# EAGLE schematic FaceCam (EAGLE 9.3.1)

## Sheet 1 of 2
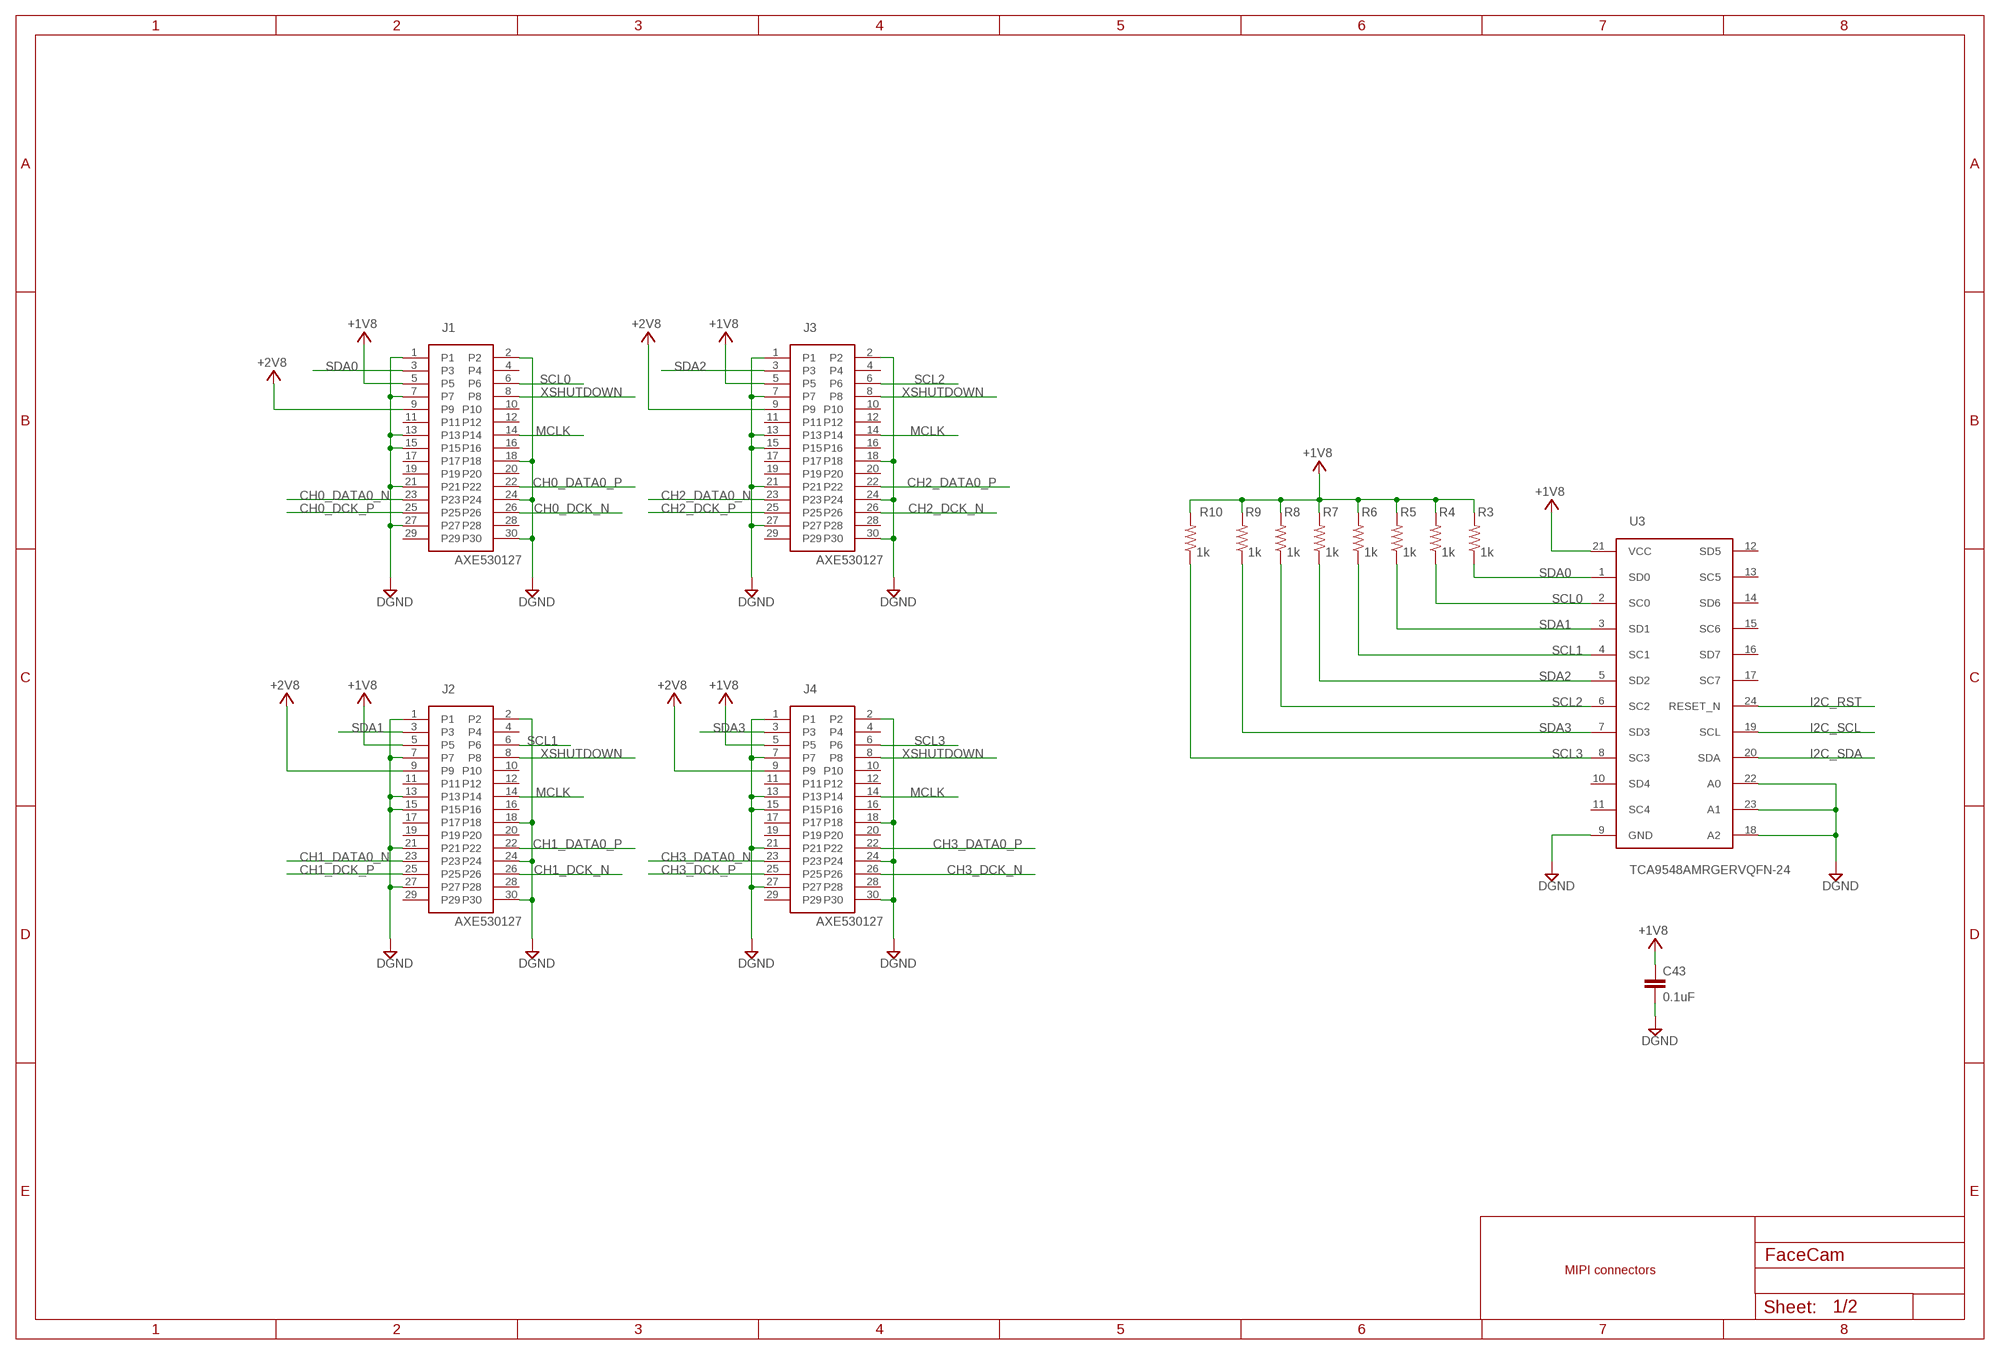
[diagram p0: schematic, sheet 1, part 1 of 2]
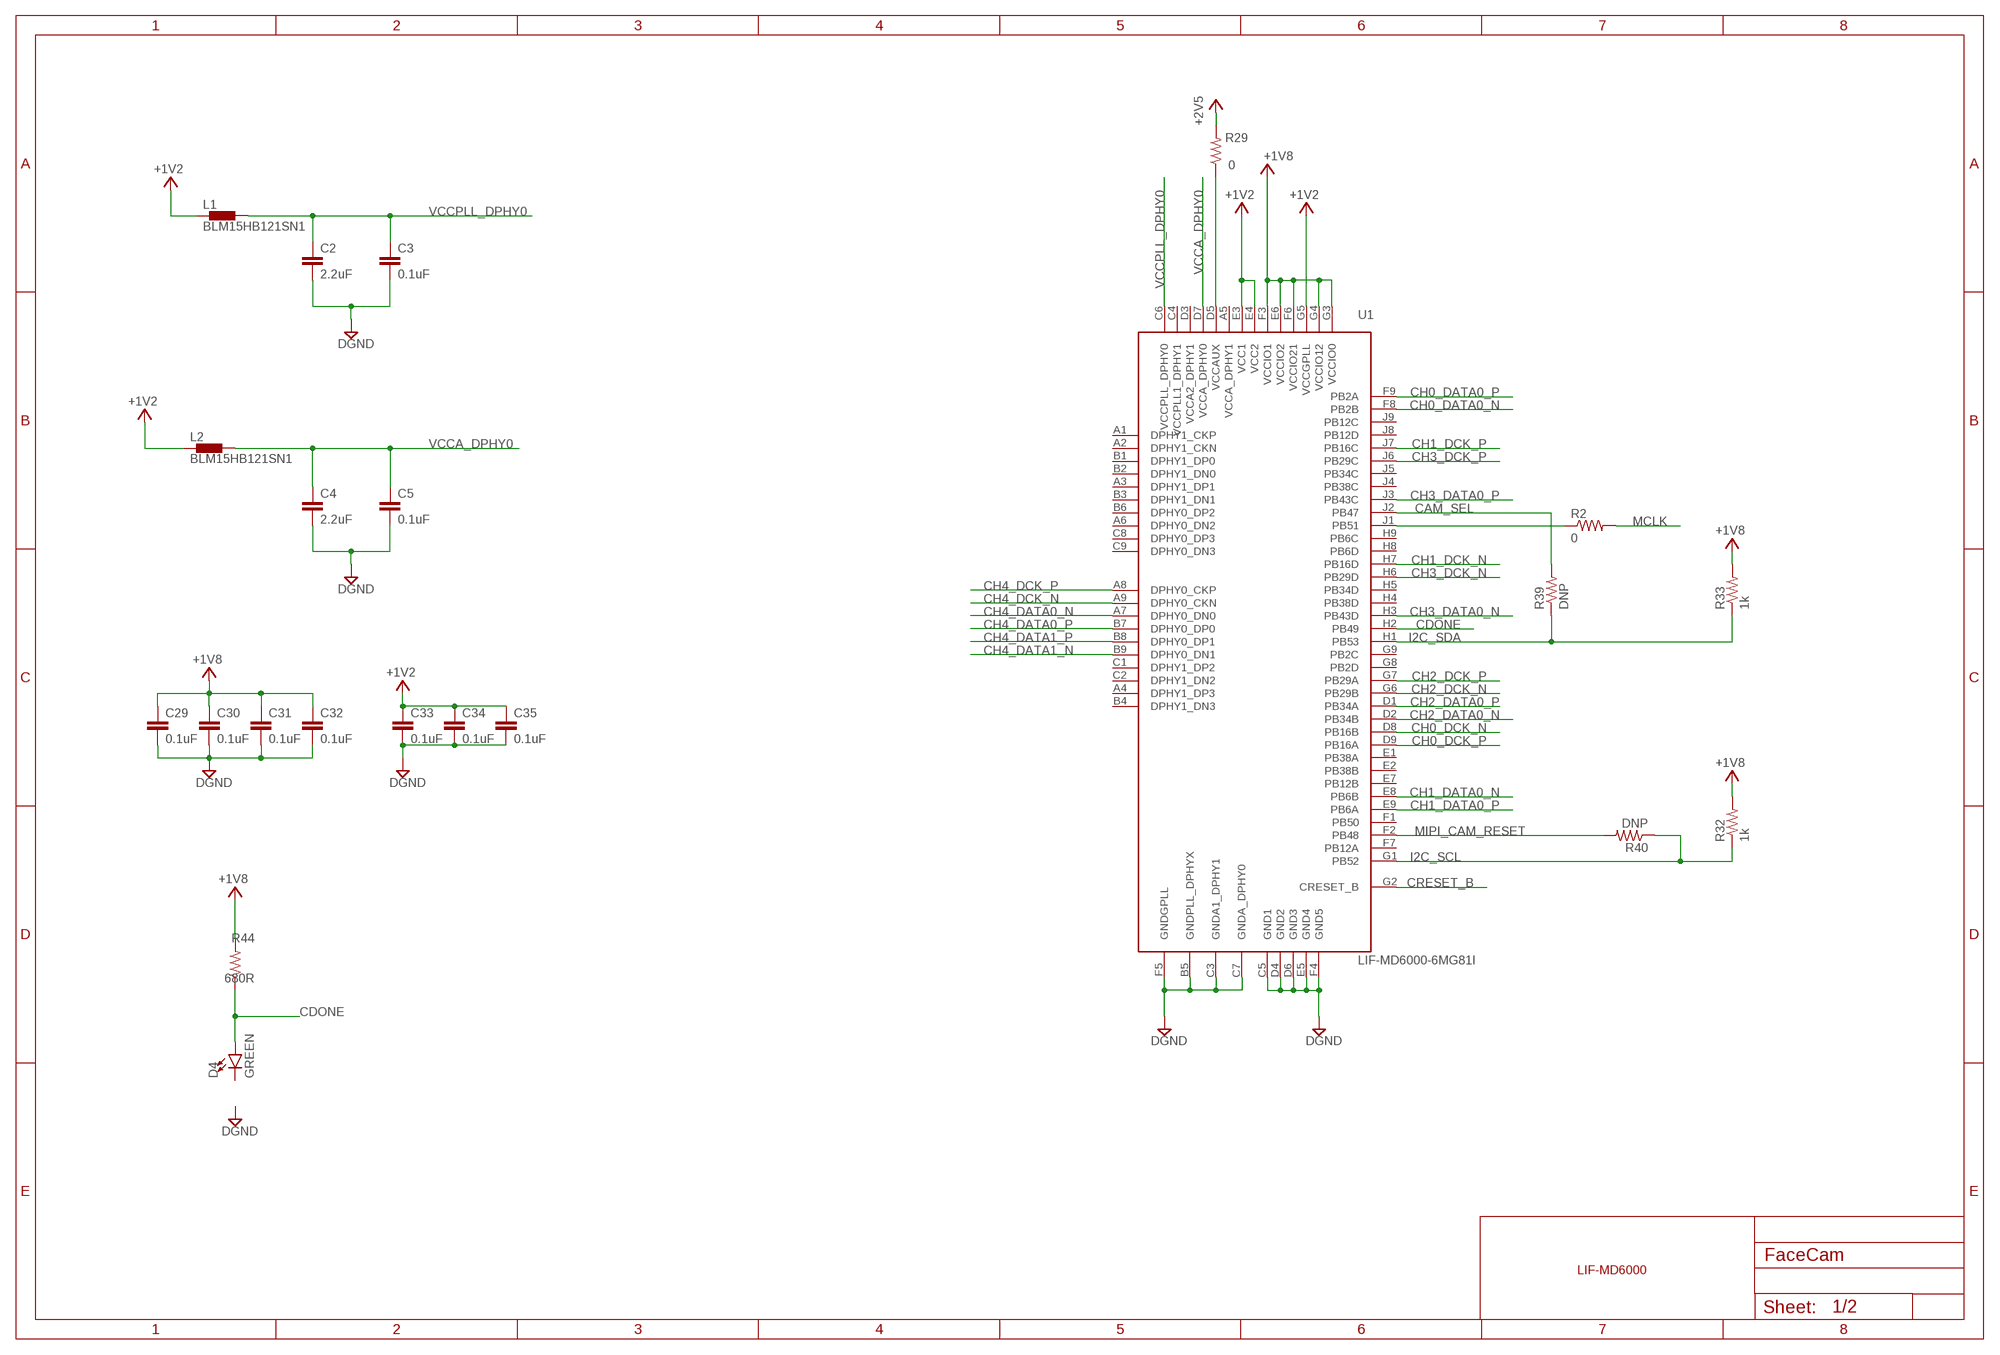
[diagram p1: schematic, sheet 1, part 2 of 2]

### Parts
C2  2.2uF  C-EUC0402  [C0402]
C3  0.1uF  C-EUC0402  [C0402]
C4  2.2uF  C-EUC0402  [C0402]
C5  0.1uF  C-EUC0402  [C0402]
C29  0.1uF  C-EUC0402  [C0402]
C30  0.1uF  C-EUC0402  [C0402]
C31  0.1uF  C-EUC0402  [C0402]
C32  0.1uF  C-EUC0402  [C0402]
C33  0.1uF  C-EUC0402  [C0402]
C34  0.1uF  C-EUC0402  [C0402]
C35  0.1uF  C-EUC0402  [C0402]
C43  0.1uF  C-EUC0402  [C0402]
D4  GREEN  LED-GREEN0603  [LED-0603]
J1  AXE530127  [AXE530127]
J2  AXE530127  [AXE530127]
J3  AXE530127  [AXE530127]
J4  AXE530127  [AXE530127]
L1  BLM15HB121SN1  [0402]
L2  BLM15HB121SN1  [0402]
R2  0  R-US_R0402  [R0402]
R3  1k  R-US_R0402  [R0402]
R4  1k  R-US_R0402  [R0402]
R5  1k  R-US_R0402  [R0402]
R6  1k  R-US_R0402  [R0402]
R7  1k  R-US_R0402  [R0402]
R8  1k  R-US_R0402  [R0402]
R9  1k  R-US_R0402  [R0402]
R10  1k  R-US_R0402  [R0402]
R29  0  R-US_R0402  [R0402]
R32  1k  R-US_R0402  [R0402]
R33  1k  R-US_R0402  [R0402]
R39  DNP  R-US_R0402  [R0402]
R40  DNP  R-US_R0402  [R0402]
R44  680R  R-US_R0402  [R0402]
U1  LIF-MD6000-6MG81I  [CSFBGA81]
U3  TCA9548AMRGERVQFN-24  [HVQFN24]

### Nets
+1V2: C33.1 C34.1 C35.1 L1.1 L2.1 U1.E3(VCC1) U1.E4(VCC2) U1.G5(VCCGPLL) ; also sheet 2
+1V8: C29.1 C30.1 C31.1 C32.1 C43.1 J1.5 J1.9 J2.5 J2.9 J3.5 J3.9 J4.5 J4.9 R3.2 R4.2 R5.2 R6.2 R7.2 R8.2 R9.2 R10.2 R32.2 R33.2 R44.2 U1.E6(VCCIO2) U1.F3(VCCIO1) U1.F6(VCCIO21) U1.G3(VCCIO0) U1.G4(VCCIO12) U3.21(VCC) ; supply symbol labelled +2V8 ; also sheet 2
+2V5: R29.2 ; also sheet 2
CAM_SEL: R39.2 U1.J2(PB47) ; also sheet 2
CDONE: D4.A R44.1 U1.H2(PB49) ; also sheet 2
CH0_DATA0_N: J1.23 U1.F8(PB2B)
CH0_DATA0_P: J1.22 U1.F9(PB2A)
CH0_DCK_N: J1.26 U1.D8(PB16B)
CH0_DCK_P: J1.25 U1.D9(PB16A)
CH1_DATA0_N: J2.23 U1.E8(PB6B)
CH1_DATA0_P: J2.22 U1.E9(PB6A)
CH1_DCK_N: J2.26 U1.H7(PB16D)
CH1_DCK_P: J2.25 U1.J7(PB16C)
CH2_DATA0_N: J3.23 U1.D2(PB34B)
CH2_DATA0_P: J3.22 U1.D1(PB34A)
CH2_DCK_N: J3.26 U1.G6(PB29B)
CH2_DCK_P: J3.25 U1.G7(PB29A)
CH3_DATA0_N: J4.23 U1.H3(PB43D)
CH3_DATA0_P: J4.22 U1.J3(PB43C)
CH3_DCK_N: J4.26 U1.H6(PB29D)
CH3_DCK_P: J4.25 U1.J6(PB29C)
CH4_DATA0_N: U1.A7(DPHY0_DN0) ; also sheet 2
CH4_DATA0_P: U1.B7(DPHY0_DP0) ; also sheet 2
CH4_DATA1_N: U1.B9(DPHY0_DN1) ; also sheet 2
CH4_DATA1_P: U1.B8(DPHY0_DP1) ; also sheet 2
CH4_DCK_N: U1.A9(DPHY0_CKN) ; also sheet 2
CH4_DCK_P: U1.A8(DPHY0_CKP) ; also sheet 2
CRESET_B: U1.G2(CRESET_B) ; also sheet 2
DGND: C2.2 C3.2 C4.2 C5.2 C29.2 C30.2 C31.2 C32.2 C33.2 C34.2 C35.2 C43.2 J1.1 J1.2 J1.7 J1.13 J1.15 J1.18 J1.21 J1.24 J1.27 J1.30 J2.1 J2.2 J2.7 J2.13 J2.15 J2.18 J2.21 J2.24 J2.27 J2.30 J3.1 J3.2 J3.7 J3.13 J3.15 J3.18 J3.21 J3.24 J3.27 J3.30 J4.1 J4.2 J4.7 J4.13 J4.15 J4.18 J4.21 J4.24 J4.27 J4.30 U1.B5(GNDPLL_DPHYX) U1.C3(GNDA1_DPHY1) U1.C5(GND1) U1.C7(GNDA_DPHY0) U1.D4(GND2) U1.D6(GND3) U1.E5(GND4) U1.F4(GND5) U1.F5(GNDGPLL) U3.9(GND) U3.18(A2) U3.22(A0) U3.23(A1) ; also sheet 2
I2C_RST: U3.24(RESET_N) ; also sheet 2
I2C_SCL: R32.1 R40.1 U1.G1(PB52) U3.19(SCL) ; also sheet 2
I2C_SDA: R33.1 R39.1 U1.H1(PB53) U3.20(SDA) ; also sheet 2
MCLK: J1.14 J2.14 J3.14 J4.14 R2.2 ; also sheet 2
MIPI_CAM_RESET: R40.2 U1.F2(PB48) ; also sheet 2
N$2: R2.1 U1.J1(PB51)
N$23: R29.1 U1.D5(VCCAUX)
SCL0: J1.6 R4.1 U3.2(SC0)
SCL1: J2.6 R6.1 U3.4(SC1)
SCL2: J3.6 R8.1 U3.6(SC2)
SCL3: J4.6 R10.1 U3.8(SC3)
SDA0: J1.3 R3.1 U3.1(SD0)
SDA1: J2.3 R5.1 U3.3(SD1)
SDA2: J3.3 R7.1 U3.5(SD2)
SDA3: J4.3 R9.1 U3.7(SD3)
VCCA_DPHY0: C4.1 C5.1 L2.2 U1.D7(VCCA_DPHY0)
VCCPLL_DPHY0: C2.1 C3.1 L1.2 U1.C6(VCCPLL_DPHY0)
XSHUTDOWN: J1.8 J2.8 J3.8 J4.8 ; also sheet 2
Unconnected: D4.C J1.4 J1.10 J1.11 J1.12 J1.16 J1.17 J1.19 J1.20 J1.28 J1.29 J2.4 J2.10 J2.11 J2.12 J2.16 J2.17 J2.19 J2.20 J2.28 J2.29 J3.4 J3.10 J3.11 J3.12 J3.16 J3.17 J3.19 J3.20 J3.28 J3.29 J4.4 J4.10 J4.11 J4.12 J4.16 J4.17 J4.19 J4.20 J4.28 J4.29 U1.A1(DPHY1_CKP) U1.A2(DPHY1_CKN) U1.A3(DPHY1_DP1) U1.A4(DPHY1_DP3) U1.A5(VCCA_DPHY1) U1.A6(DPHY0_DN2) U1.B1(DPHY1_DP0) U1.B2(DPHY1_DN0) U1.B3(DPHY1_DN1) U1.B4(DPHY1_DN3) U1.B6(DPHY0_DP2) U1.C1(DPHY1_DP2) U1.C2(DPHY1_DN2) U1.C4(VCCPLL1_DPHY1) U1.C8(DPHY0_DP3) U1.C9(DPHY0_DN3) U1.D3(VCCA2_DPHY1) U1.E1(PB38A) U1.E2(PB38B) U1.E7(PB12B) U1.F1(PB50) U1.F7(PB12A) U1.G8(PB2D) U1.G9(PB2C) U1.H4(PB38D) U1.H5(PB34D) U1.H8(PB6D) U1.H9(PB6C) U1.J4(PB38C) U1.J5(PB34C) U1.J8(PB12D) U1.J9(PB12C) U3.10(SD4) U3.11(SC4) U3.12(SD5) U3.13(SC5) U3.14(SD6) U3.15(SC6) U3.16(SD7) U3.17(SC7)

### Notes on the sheet
- MIPI connectors | LIF-MD6000

## Sheet 2 of 2
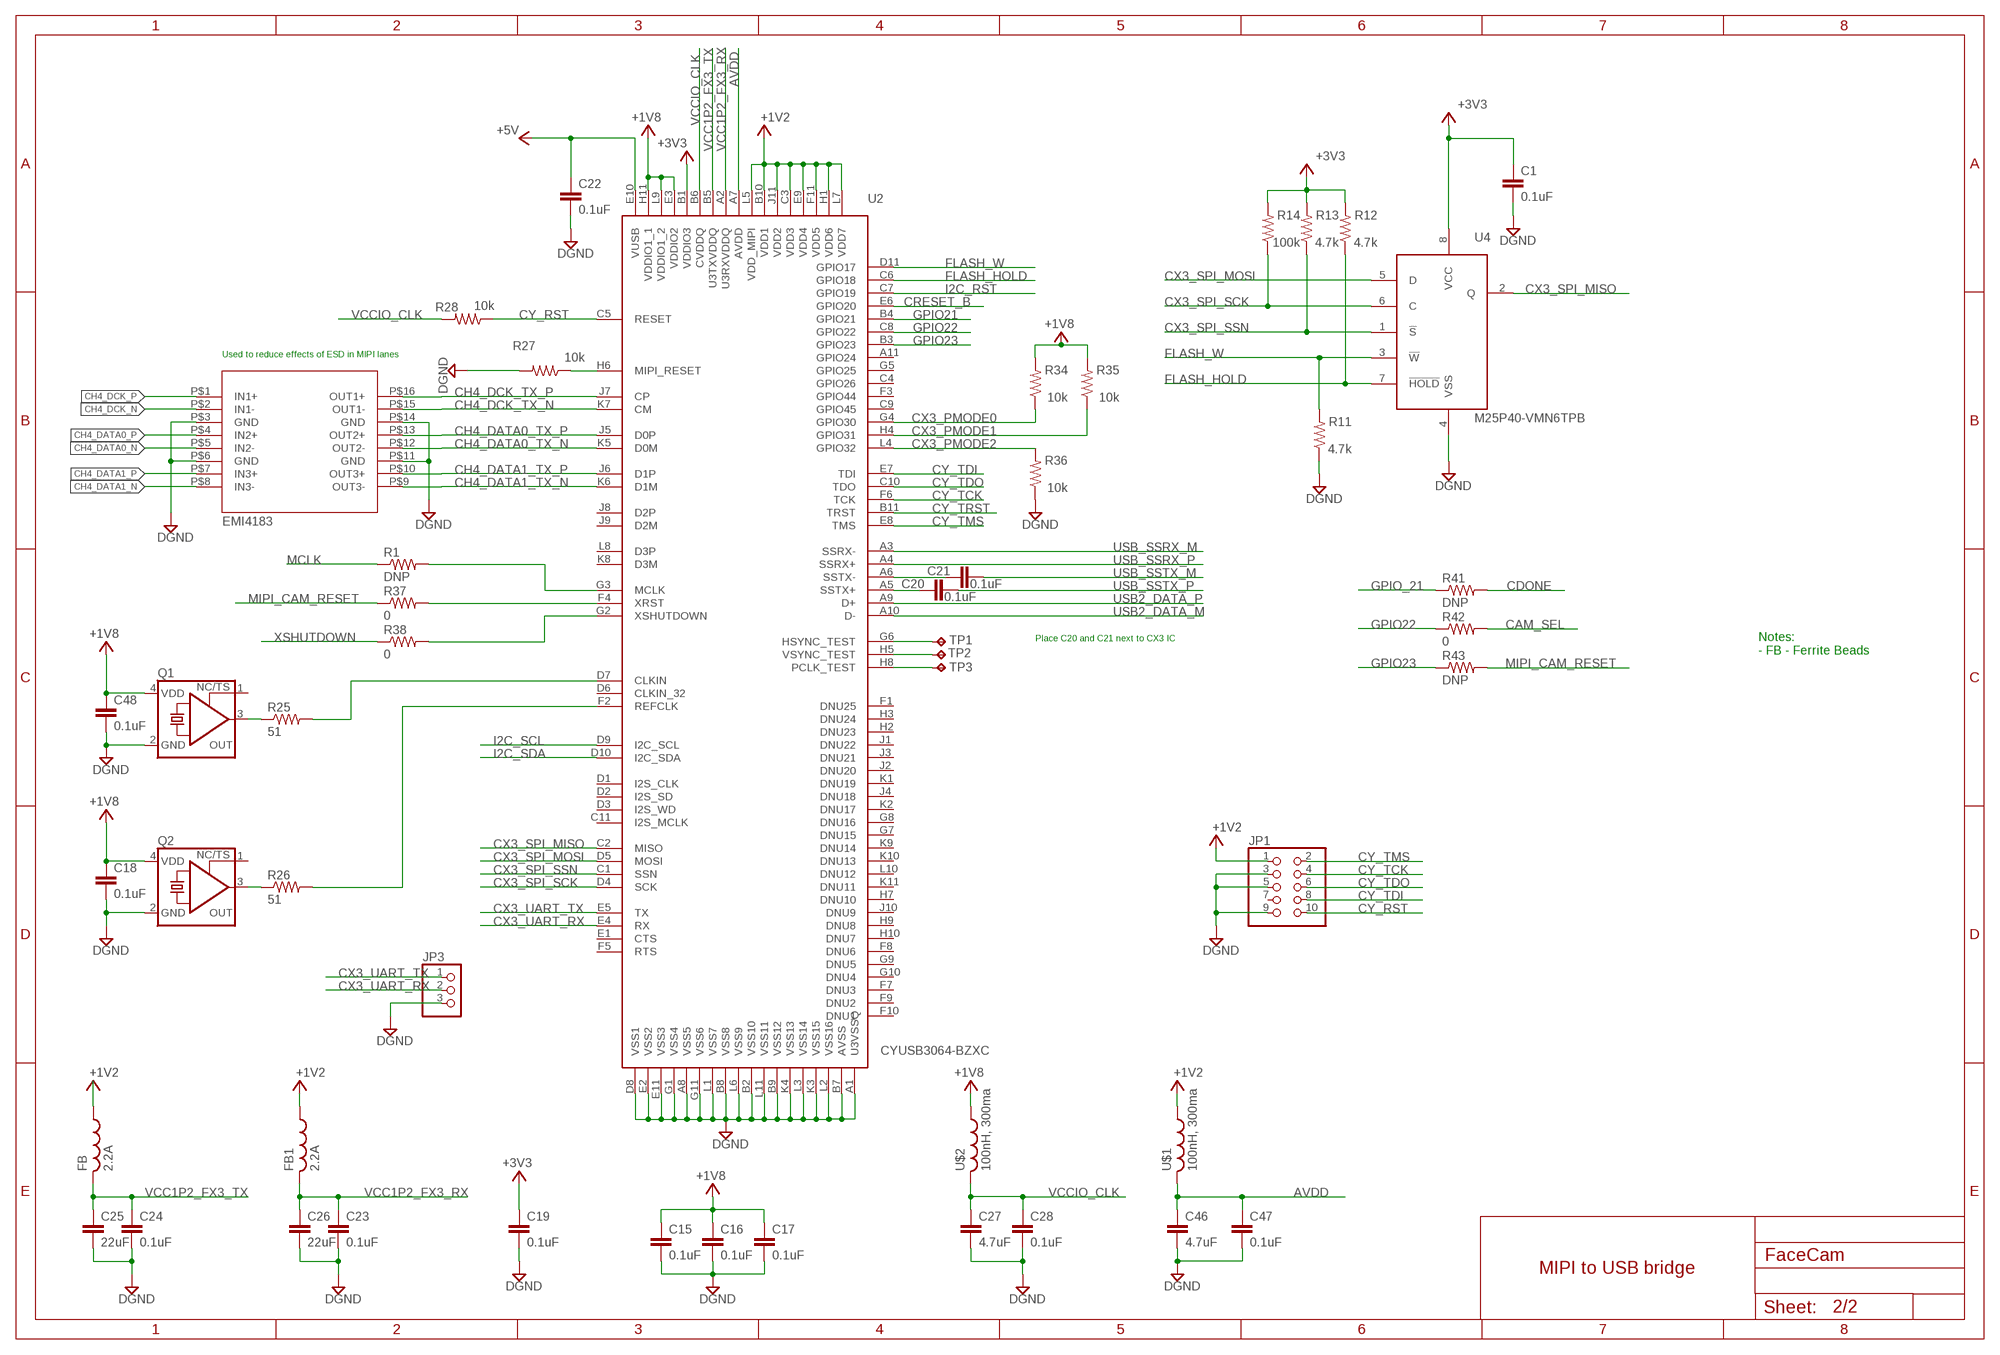
[diagram p2: schematic, sheet 2, part 1 of 2]
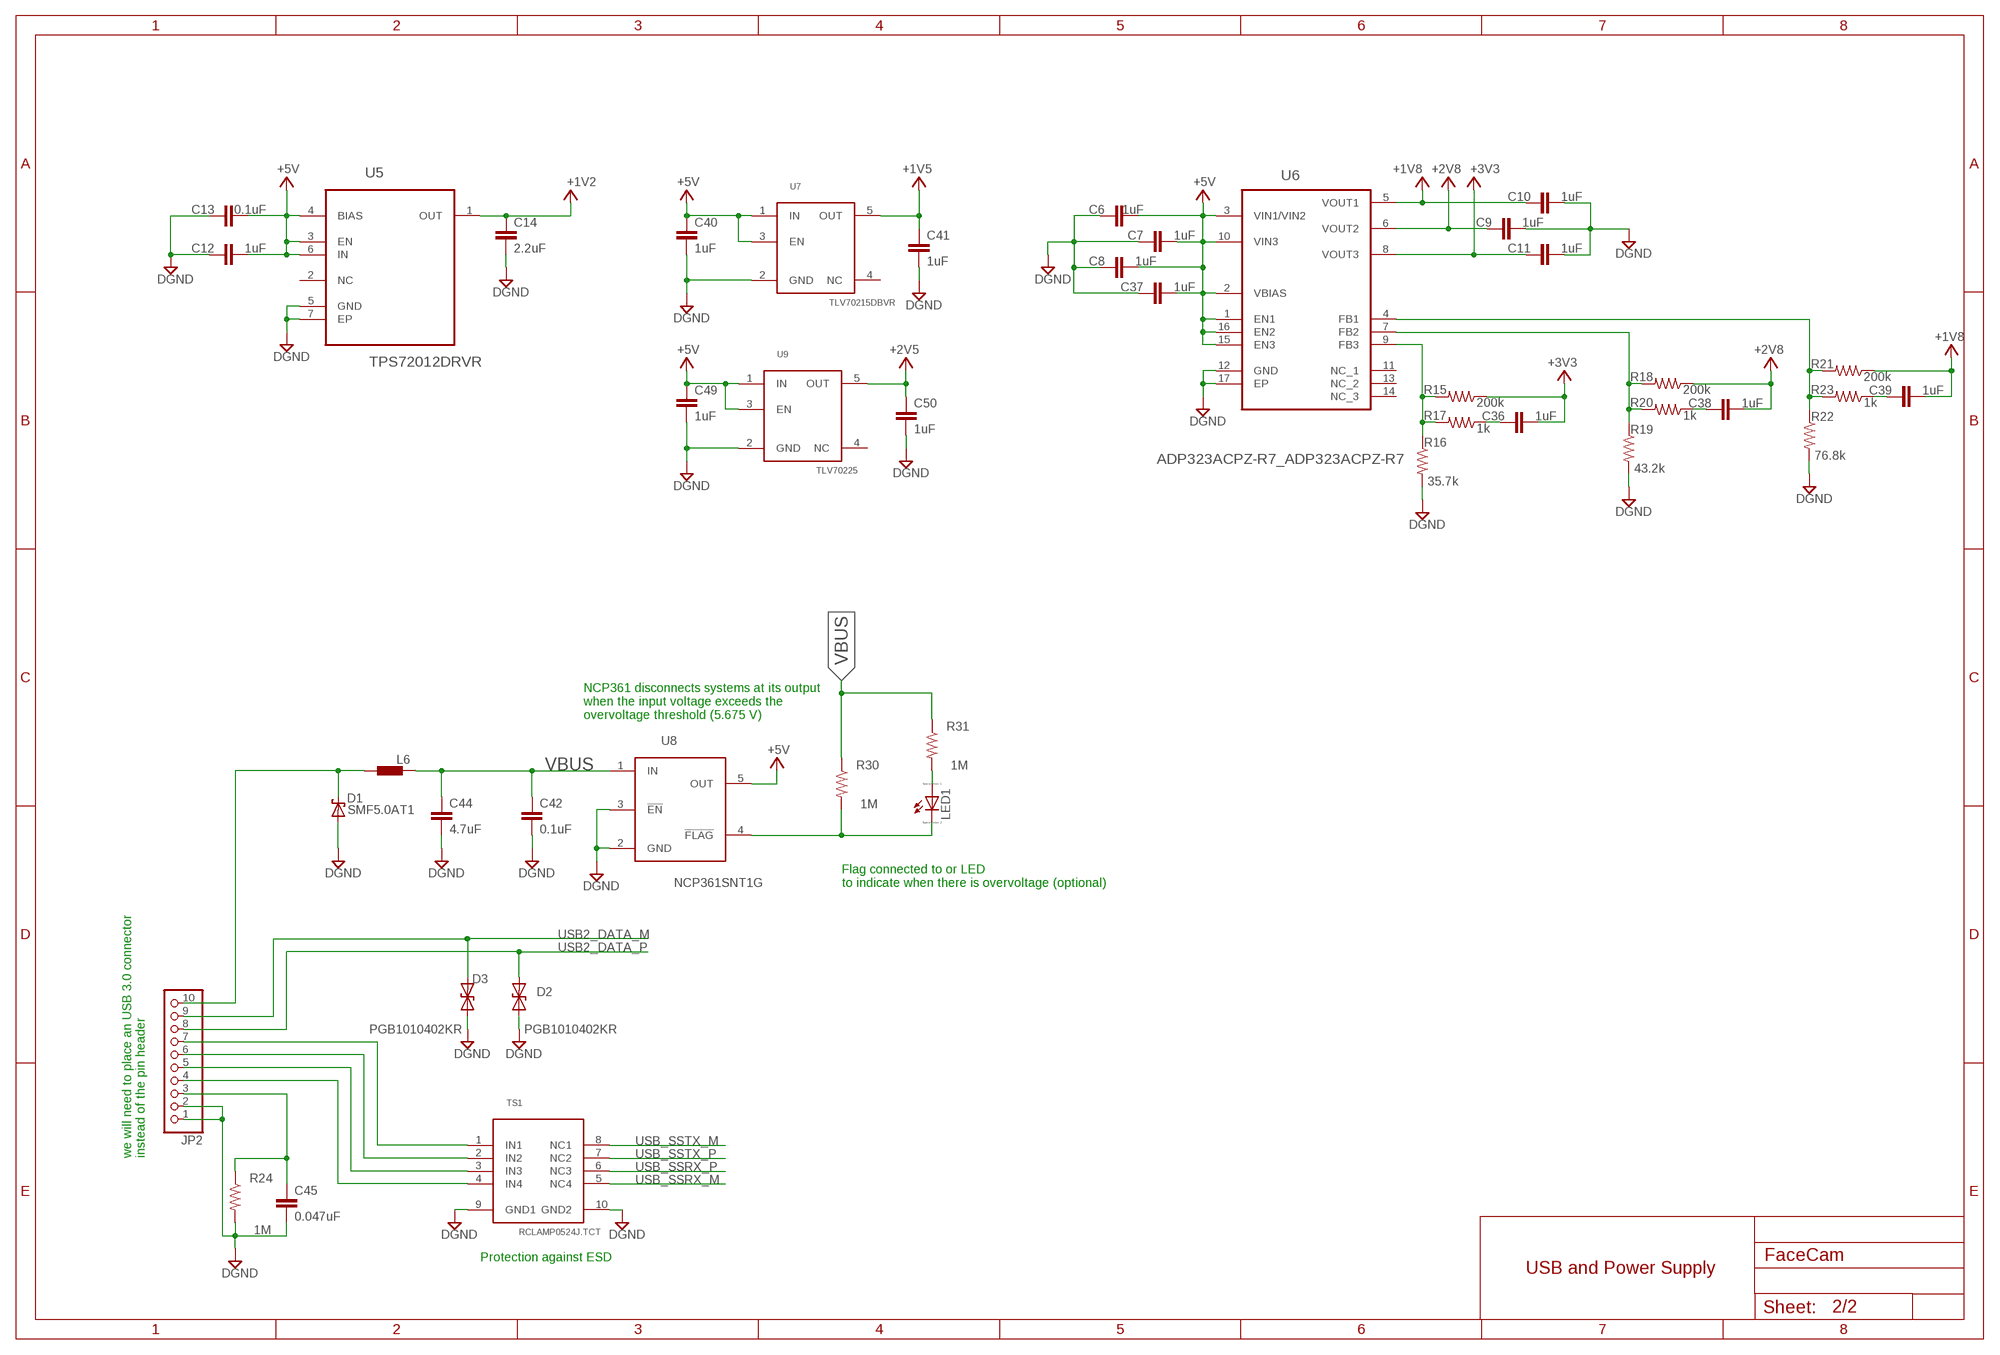
[diagram p3: schematic, sheet 2, part 2 of 2]

### Parts
C1  0.1uF  C-EUC0402  [C0402]
C6  1uF  C-EUC0402  [C0402]
C7  1uF  C-EUC0402  [C0402]
C8  1uF  C-EUC0402  [C0402]
C9  1uF  C-EUC0402  [C0402]
C10  1uF  C-EUC0402  [C0402]
C11  1uF  C-EUC0402  [C0402]
C12  1uF  C-EUC0402  [C0402]
C13  0.1uF  C-EUC0402  [C0402]
C14  2.2uF  C-EUC0402  [C0402]
C15  0.1uF  C-EUC0402  [C0402]
C16  0.1uF  C-EUC0402  [C0402]
C17  0.1uF  C-EUC0402  [C0402]
C18  0.1uF  C-EUC0402  [C0402]
C19  0.1uF  C-EUC0402  [C0402]
C20  0.1uF  C-EUC0402  [C0402]
C21  0.1uF  C-EUC0402  [C0402]
C22  0.1uF  C-EUC0402  [C0402]
C23  0.1uF  C-EUC0402  [C0402]
C24  0.1uF  C-EUC0402  [C0402]
C25  22uF  C-EUC0805  [C0805]
C26  22uF  C-EUC0805  [C0805]
C27  4.7uF  C-EUC0402  [C0402]
C28  0.1uF  C-EUC0402  [C0402]
C36  1uF  C-EUC0402  [C0402]
C37  1uF  C-EUC0402  [C0402]
C38  1uF  C-EUC0402  [C0402]
C39  1uF  C-EUC0402  [C0402]
C40  1uF  C-EUC0402  [C0402]
C41  1uF  C-EUC0402  [C0402]
C42  0.1uF  C-EUC0402  [C0402]
C44  4.7uF  C-EUC0805  [C0805]
C45  0.047uF  C-EUC0402  [C0402]
C46  4.7uF  C-EUC0402  [C0402]
C47  0.1uF  C-EUC0402  [C0402]
C48  0.1uF  C-EUC0402  [C0402]
C49  1uF  C-EUC0402  [C0402]
C50  1uF  C-EUC0402  [C0402]
D1  SMF5.0AT1  [SOD123FL]
D2  PGB1010402KR  [DIODE0402]
D3  PGB1010402KR  [DIODE0402]
EMI4183  EMI4183  [WDFN16]
FB  2.2A  INDUCTOR_0402_N  [RESC0402_N]
FB1  2.2A  INDUCTOR_0402_N  [RESC0402_N]
JP1  PINHD-2X5  [2X05]
JP2  PINHD-1X10  [1X10]
JP3  PINHD-1X3  [1X03]
L6  BLM15HG601SN1  [0402]
LED1  LED_ESML0603  [LED_SML0603]
Q1  KXO-PXO/XO-V94  [2.0X1.6_KXO-V94]
Q2  KXO-PXO/XO-V94  [2.0X1.6_KXO-V94]
R1  DNP  R-US_R0402  [R0402]
R11  4.7k  R-US_R0402  [R0402]
R12  4.7k  R-US_R0402  [R0402]
R13  4.7k  R-US_R0402  [R0402]
R14  100k  R-US_R0402  [R0402]
R15  200k  R-US_R0402  [R0402]
R16  35.7k  R-US_R0402  [R0402]
R17  1k  R-US_R0402  [R0402]
R18  200k  R-US_R0402  [R0402]
R19  43.2k  R-US_R0402  [R0402]
R20  1k  R-US_R0402  [R0402]
R21  200k  R-US_R0402  [R0402]
R22  76.8k  R-US_R0402  [R0402]
R23  1k  R-US_R0402  [R0402]
R24  1M  R-US_R0402  [R0402]
R25  51  R-US_R0402  [R0402]
R26  51  R-US_R0402  [R0402]
R27  10k  R-US_R0402  [R0402]
R28  10k  R-US_R0402  [R0402]
R30  1M  R-US_R0402  [R0402]
R31  1M  R-US_R0402  [R0402]
R34  10k  R-US_R0402  [R0402]
R35  10k  R-US_R0402  [R0402]
R36  10k  R-US_R0402  [R0402]
R37  0  R-US_R0402  [R0402]
R38  0  R-US_R0402  [R0402]
R41  DNP  R-US_R0402  [R0402]
R42  0  R-US_R0402  [R0402]
R43  DNP  R-US_R0402  [R0402]
TP1  TPB1,27  [B1,27]
TP2  TPB1,27  [B1,27]
TP3  TPB1,27  [B1,27]
TS1  RCLAMP0524J.TCT  [RCLAMP0524J]
U2  CYUSB3064-BZXC  [BGA121]
U4  M25P40-VMN6TPB  [SOIC8]
U5  TPS72012DRVR  [SON65P200X200X80-7N]
U6  ADP323ACPZ-R7_ADP323ACPZ-R7  [ADP323ACPZ-R7_QFN50P300X300X80-17N]
U7  TLV70215DBVR  [SOT23-5]
U8  NCP361SNT1G  [SOT23-5]
U9  TLV70225  [SOT23-5]
U$1  100nH, 300ma  INDUCTOR_0402_N  [RESC0402_N]
U$2  100nH, 300ma  INDUCTOR_0402_N  [RESC0402_N]

### Nets
+1V2: C14.2 FB1.1 FB.1 JP1.1 U2.B10(VDD1) U2.C3(VDD3) U2.E9(VDD4) U2.F11(VDD5) U2.H1(VDD6) U2.J11(VDD2) U2.L5(VDD_MIPI) U2.L7(VDD7) U5.1(OUT) U$1.1 ; also sheet 1
+1V5: C41.2 U7.5(OUT)
+1V8: C10.1 C15.1 C16.1 C17.1 C18.1 C39.2 C48.1 Q1.4(VDD) Q2.4(VDD) R21.1 R34.2 R35.2 U2.E3(VDDIO2) U2.H11(VDDIO1_1) U2.L9(VDDIO1_2) U6.5(VOUT1) U$2.1 ; also sheet 1
+2V5: C50.2 U9.5(OUT) ; also sheet 1
+2V8: C9.1 C38.2 R18.1 U6.6(VOUT2)
+3V3: C1.1 C11.1 C19.1 C36.2 R12.2 R13.2 R14.2 R15.1 U2.B1(VDDIO3) U4.8(VCC) U6.8(VOUT3)
+5V: C6.2 C7.2 C8.2 C12.2 C13.2 C22.1 C37.2 C40.2 C49.2 U2.E10(VUSB) U5.3(EN) U5.4(BIAS) U5.6(IN) U6.1(EN1) U6.2(VBIAS) U6.3(VIN1/VIN2) U6.10(VIN3) U6.15(EN3) U6.16(EN2) U7.1(IN) U7.3(EN) U8.5(OUT) U9.1(IN) U9.3(EN)
AVDD: C46.1 C47.1 U2.A7(AVDD) U$1.2
CAM_SEL: R42.2 ; also sheet 1
CDONE: R41.2 ; also sheet 1
CH4_DATA0_N: EMI4183.P$5(IN2-) ; also sheet 1
CH4_DATA0_P: EMI4183.P$4(IN2+) ; also sheet 1
CH4_DATA0_TX_N: EMI4183.P$12(OUT2-) U2.K5(D0M)
CH4_DATA0_TX_P: EMI4183.P$13(OUT2+) U2.J5(D0P)
CH4_DATA1_N: EMI4183.P$8(IN3-) ; also sheet 1
CH4_DATA1_P: EMI4183.P$7(IN3+) ; also sheet 1
CH4_DATA1_TX_N: EMI4183.P$9(OUT3-) U2.K6(D1M)
CH4_DATA1_TX_P: EMI4183.P$10(OUT3+) U2.J6(D1P)
CH4_DCK_N: EMI4183.P$2(IN1-) ; also sheet 1
CH4_DCK_P: EMI4183.P$1(IN1+) ; also sheet 1
CH4_DCK_TX_N: EMI4183.P$15(OUT1-) U2.K7(CM)
CH4_DCK_TX_P: EMI4183.P$16(OUT1+) U2.J7(CP)
CRESET_B: U2.E6(GPIO20) ; also sheet 1
CX3_PMODE0: R34.1 U2.G4(GPIO30)
CX3_PMODE1: R35.1 U2.H4(GPIO31)
CX3_PMODE2: R36.2 U2.L4(GPIO32)
CX3_SPI_MISO: U2.C2(MISO) U4.2(Q)
CX3_SPI_MOSI: U2.D5(MOSI) U4.5(D)
CX3_SPI_SCK: R14.1 U2.D4(SCK) U4.6(C)
CX3_SPI_SSN: R13.1 U2.C1(SSN) U4.1(!S)
CX3_UART_RX: JP3.2 U2.E4(RX)
CX3_UART_TX: JP3.1 U2.E5(TX)
CY_RST: JP1.10 R28.1 U2.C5(RESET)
CY_TCK: JP1.4 U2.F6(TCK)
CY_TDI: JP1.8 U2.E7(TDI)
CY_TDO: JP1.6 U2.C10(TDO)
CY_TMS: JP1.2 U2.E8(TMS)
CY_TRST: U2.B11(TRST)
DGND: C1.2 C6.1 C7.1 C8.1 C9.2 C10.2 C11.2 C12.1 C13.1 C14.1 C15.2 C16.2 C17.2 C18.2 C19.2 C22.2 C23.2 C24.2 C25.2 C26.2 C27.2 C28.2 C37.1 C40.1 C41.1 C42.2 C44.2 C45.2 C46.2 C47.2 C48.2 C49.1 C50.1 D1.A D2.1 D3.1 EMI4183.P$3(GND) EMI4183.P$6(GND) EMI4183.P$11(GND) EMI4183.P$14(GND) JP1.3 JP1.5 JP1.9 JP2.1 JP2.2 JP3.3 Q1.2(GND) Q2.2(GND) R11.1 R16.2 R19.2 R22.2 R24.2 R27.2 R36.1 TS1.9(GND1) TS1.10(GND2) U2.A1(U3VSSQ) U2.A8(VSS5) U2.B2(VSS10) U2.B7(AVSS) U2.B8(VSS8) U2.B9(VSS12) U2.D8(VSS1) U2.E2(VSS2) U2.E11(VSS3) U2.G1(VSS4) U2.G11(VSS6) U2.K3(VSS15) U2.K4(VSS13) U2.L1(VSS7) U2.L2(VSS16) U2.L3(VSS14) U2.L6(VSS9) U2.L11(VSS11) U4.4(VSS) U5.5(GND) U5.7(EP) U6.12(GND) U6.17(EP) U7.2(GND) U8.2(GND) U8.3(!EN) U9.2(GND) ; also sheet 1
FLAG: LED1.C R30.2 U8.4(!FLAG)
FLASH_HOLD: R12.1 U2.C6(GPIO18) U4.7(!HOLD)
FLASH_W: R11.2 U2.D11(GPIO17) U4.3(!W)
GPIO21: U2.B4(GPIO21)
GPIO22: R42.1 U2.C8(GPIO22)
GPIO23: R43.1 U2.B3(GPIO23)
GPIO_21: R41.1
I2C_RST: U2.C7(GPIO19) ; also sheet 1
I2C_SCL: U2.D9(I2C_SCL) ; also sheet 1
I2C_SDA: U2.D10(I2C_SDA) ; also sheet 1
MCLK: R1.1 ; also sheet 1
MIPI_CAM_RESET: R37.1 R43.2 ; also sheet 1
N$1: R1.2 U2.G3(MCLK)
N$3: R15.2 R16.1 R17.2 U6.9(FB3)
N$4: D1.C JP2.10 L6.2
N$5: Q1.3(OUT) R25.1
N$6: LED1.A R31.2
N$7: Q2.3(OUT) R26.1
N$8: C45.1 JP2.3 R24.1
N$9: R25.2 U2.D7(CLKIN)
N$10: R26.2 U2.F2(REFCLK)
N$11: R27.1 U2.H6(MIPI_RESET)
N$12: C36.1 R17.1
N$13: R37.2 U2.F4(XRST)
N$14: TP1.TP U2.G6(HSYNC_TEST)
N$15: R38.2 U2.G2(XSHUTDOWN)
N$16: TP2.TP U2.H5(VSYNC_TEST)
N$17: TP3.TP U2.H8(PCLK_TEST)
N$21: R18.2 R19.1 R20.2 U6.7(FB2)
N$22: C38.1 R20.1
N$25: R21.2 R22.1 R23.2 U6.4(FB1)
N$26: C39.1 R23.1
N$27: C21.1 U2.A6(SSTX-)
N$28: C20.1 U2.A5(SSTX+)
N$33: JP2.7 TS1.1(IN1)
N$34: JP2.6 TS1.2(IN2)
N$35: JP2.5 TS1.3(IN3)
N$36: JP2.4 TS1.4(IN4)
USB2_DATA_M: D3.2 JP2.9 U2.A10(D-)
USB2_DATA_P: D2.2 JP2.8 U2.A9(D+)
USB_SSRX_M: TS1.5(NC4) U2.A3(SSRX-)
USB_SSRX_P: TS1.6(NC3) U2.A4(SSRX+)
USB_SSTX_M: C21.2 TS1.8(NC1)
USB_SSTX_P: C20.2 TS1.7(NC2)
VBUS: C42.1 C44.1 L6.1 R30.1 R31.1 U8.1(IN)
VCC1P2_FX3_RX: C23.1 C26.1 FB1.2 U2.A2(U3RXVDDQ)
VCC1P2_FX3_TX: C24.1 C25.1 FB.2 U2.B5(U3TXVDDQ)
VCCIO_CLK: C27.1 C28.1 R28.2 U2.B6(CVDDQ) U$2.2
XSHUTDOWN: R38.1 ; also sheet 1
Unconnected: JP1.7 Q1.1(TS) Q2.1(TS) U2.A11(GPIO24) U2.C4(GPIO26) U2.C9(GPIO45) U2.C11(I2S_MCLK) U2.D1(I2S_CLK) U2.D2(I2S_SD) U2.D3(I2S_WD) U2.D6(CLKIN_32) U2.E1(CTS) U2.F1(DNU25) U2.F3(GPIO44) U2.F5(RTS) U2.F7(DNU3) U2.F8(DNU6) U2.F9(DNU2) U2.F10(DNU1) U2.G5(GPIO25) U2.G7(DNU15) U2.G8(DNU16) U2.G9(DNU5) U2.G10(DNU4) U2.H2(DNU23) U2.H3(DNU24) U2.H7(DNU10) U2.H9(DNU8) U2.H10(DNU7) U2.J1(DNU22) U2.J2(DNU20) U2.J3(DNU21) U2.J4(DNU18) U2.J8(D2P) U2.J9(D2M) U2.J10(DNU9) U2.K1(DNU19) U2.K2(DNU17) U2.K8(D3M) U2.K9(DNU14) U2.K10(DNU13) U2.K11(DNU11) U2.L8(D3P) U2.L10(DNU12) U5.2(NC) U6.11(NC_1) U6.13(NC_2) U6.14(NC_3) U7.4(NC) U9.4(NC)

### Notes on the sheet
- Used to reduce effects of ESD in MIPI lanes
- Place C20 and C21 next to CX3 IC
- Notes:
  - FB - Ferrite Beads
- Notes:
  - FB - Ferrite Beads
- NCP361 disconnects systems at its output
  when the input voltage exceeds the
  overvoltage threshold (5.675 V)
- Flag connected to or LED
  to indicate when there is overvoltage (optional)
- we will need to place an USB 3.0 connector 
  instead of the pin header
- Protection against ESD
- MIPI to USB bridge | USB and Power Supply

## Library data of the parts
C1-C24 C27-C43 C45-C50 = rcl:C-EU: CAPACITOR, European symbol; SPICEPREFIX: C
C25 C26 C44 = resistor:C-EU: CAPACITOR, European symbol
D1 = diode:SMF5.0AT1: 200 W Transient Voltage Suppressor Source: Data sheet <http://www.onsemi.com/pub_link/Collateral/SMF5.0AT1-D.PDF>
D2 D3 = diode:PGB1010402KR
D4 = SparkFun-LED:LED-GREEN: Green SMD LED Used in manufacturing of various products at SparkFun Packages: 0603 - SMD 0603 package [Product Link] <http://www.futureelectronics.com/en/technologies/semiconductors/optoelectronics/leds/Pages/9894312-LTST-C190GKT.aspx?CrossPart=HSMG-C190&IM=0> LilyPad 1206 - SMD1206 LilyPad package [Product Link] <http://www.futureelectronics.com/en/Technologies/Product.aspx?ProductID=IN150NGHARVATEKCORPORATION2049943&IM=0> 1206 - SMD1206 package [Product Link] <http://www.futureelectronics.com/en/technologies/semiconductors/optoelectronics/leds/Pages/8315665-LTST-C150KGKT.aspx?IM=0> 1206 Bottom Mount -SMD 1206 Bottom Mount [Product Link] <http://www.digikey.com/product-detail/en/lite-on-inc/LTST-C230KGKT/160-1456-1-ND/386854> SparkFun Products: Pro Mini 328 -5V <https://www.sparkfun.com/products/821> RedBoard <https://www.sparkfun.com/products/12757> MP3 Trigger <https://www.sparkfun.com/products/13720> Makey Makey <https://www.sparkfun.com/products/11076>; PROD_ID: DIO-00821
EMI4183 = yhtomit_ICs:EMI4183
FB FB1 U$1 U$2 = Nordic_nRF:INDUCTOR: Generic chip inductor
J1-J4 = library:AXE530127
JP1 = pinhead:PINHD-2X5: PIN HEADER
JP2 = pinhead:PINHD-1X10: PIN HEADER
JP3 = pinhead:PINHD-1X3: PIN HEADER
L1 L2 L6 = inductors:BLM15H: EMIFIL (R) Chip Ferrite Bead for GHz Noise Source: http://www.murata.com/ Ferrite Bead BLM15H.pdf
LED1 = eagle-ltspice:LED_E: LED Source: http://www.osram.convergy.de Source: www.luxeon.com Source: www.kingbright.com; SPICEMODEL: NONE; SPICEPREFIX: D; SPICETYPE: diode
Q1 Q2 = crystal-geyer_V1_0:KXO-PXO/XO-V: Clock Oscillator (PXO/XO) MHz : KXO-V - Serie Model Size l/w/h [mm] Frequency Range Frequency Stability Temp. Range [°C] Output AECQ 200 availabel Datasheet KXO-V94 KXO-V94 KXO-V95 KXO-V95 KXO-V96 KXO-V96 KXO-V99 KXO-V99 KXO-97 KXO-V97 KXO-97 - KXO-V97 2.0/1.6/0.80 2.0/1.6/0.80 2.5/2.0/0.82 2.5/2.0/0.82 3.2/2.5/1.2 3.2/2.5/1.2 5.0/3.2/1.2 5.0/3.2/1.2 7.0/5.08/1.3 7.0/5.08/1.3 7.0/5.08/1.3 32,768 kHz 1,0 ~ 80,0 MHz 32,768 kHz 1,0 ~ 70,0 MHz 32,768 kHz 1,0 ~ 156,0 MHz 32,768 kHz 1,0 ~ 200,0 MHz 32,768 kHz 32,768 kHz 1,0 ~ 160,0 MHz ±25 … ±100ppm ±25 … ±100ppm ±25 … ±100ppm ±25 … ±100ppm ±25 … ±100ppm ±25 … ±100ppm ±25 … ±100ppm ±25 … ±100ppm ±25 … ±100ppm ±25 … ±100ppm ±25 … ±100ppm (*) -40°C …+85°C (*) -40°C …+85°C (*) -40°C …+85°C (*) -40°C …+85°C (*) -40°C …+85°C (*) -40°C …+85°C (*) -40°C …+85°C (*) -40°C …+85°C (*) -40°C …+85°C (*) -40°C …+85°C (*) -40°C …+85°C HCMOS HCMOS HCMOS HCMOS HCMOS HCMOS HCMOS HCMOS HCMOS HCMOS HCMOS - - yes yes yes yes - - - - - KXO-V94-kHz.pdf <http://www.geyer-electronic.de/uploads/tx_userartikelfrequenz/GEYER-KXO-V94-kHz.pdf> KXO-V94.pdf <http://www.geyer-electronic.de/uploads/tx_userartikelfrequenz/GEYER-KXO-V94.pdf> KXO-V95-kHz.pdf <http://www.geyer-electronic.de/uploads/tx_userartikelfrequenz/GEYER-KXO-V95-kHz.pdf> KXO-V95.pdf <http://www.geyer-electronic.de/uploads/tx_userartikelfrequenz/GEYER-KXO-V95.pdf> KXO-V96-kHz.pdf <http://www.geyer-electronic.de/uploads/tx_userartikelfrequenz/GEYER-KXO-V96-kHz.pdf> KXO-V96.pdf <http://www.geyer-electronic.de/uploads/tx_userartikelfrequenz/GEYER-KXO-V96.pdf> KXO-V99-kHz.pdf <http://www.geyer-electronic.de/uploads/tx_userartikelfrequenz/GEYER-KXO-V99-kHz.pdf> KXO-V99.pdf <http://www.geyer-electronic.de/uploads/tx_userartikelfrequenz/GEYER-KXO-V99.pdf> KXO-97-kHz.pdf <http://www.geyer-electronic.de/uploads/tx_userartikelfrequenz/GEYER-KXO-97-kHz.pdf> KXO-V97-kHz.pdf <http://www.geyer-electronic.de/uploads/tx_userartikelfrequenz/GEYER-KXO-V97-kHz.pdf> KXO-V97.pdf <http://www.geyer-electronic.de/uploads/tx_userartikelfrequenz/GEYER-KXO-V97.pdf> <http://www.geyer-electronic.de/fileadmin/template/img/logo-geyer-electronic.png> Details see: http://www.geyer-electronic.de/Frequenz-Produkte.9.0.html Created 2016-06-07, Hans Locher 2016 (C) Geyer Quartz Technology Hans Locher KXOV94,KXOV95;KXOV96;KXOV97;KXO97;2016;2520;3225;5032;70508;2,5x2,0;3,2x2,5;5,0x3,2;7,0x5,08;2.5x2.0;3.2x2.5;5.0x3.2;7.0x5.08;
R1-R44 = rcl:R-US_: RESISTOR, American symbol; SPICEPREFIX: R
TP1-TP3 = testpad:TP: Test pad
TS1 = library:RCLAMP0524J.TCT
U1 = library:LIF-MD6000-6MG81I
U2 = library:CYUSB3064-BZXC
U3 = library:TCA9548AMRGER: Low-Voltage 8-Channel I2C Switch
U4 = library:M25P40-VMN6TPB
U5 = TPS72012DRVR:TPS72012DRVR: 350mA, Ultra-Low VIN, RF Low-Dropout Linear Regulator with Bias Pin; AVAILABILITY: Unavailable; DESCRIPTION: 350mA, Ultra-Low VIN, RF Low-Dropout Linear Regulator with Bias Pin 6-WSON -40 to 125; MF: Texas Instruments; MP: TPS72012DRVR; PACKAGE: SON-6 Texas Instruments; PRICE: None
U6 = FaceCam:ADP323ACPZ-R7_ADP323ACPZ-R7: Triple, 200 mA, Low Noise, High PSRR Voltage Regulator; DESCRIPTION: LDO Regulator Pos 0.5V to 5V 0.2A 16-Pin LFCSP EP T/R; DIGI-KEY_PART_NUMBER: ADP323ACPZ-R7CT-ND; DIGI-KEY_PURCHASE_URL: https://www.digikey.co.th/product-detail/en/analog-devices-inc/ADP323ACPZ-R7/ADP323ACPZ-R7CT-ND/2507303?utm_source=snapeda&utm_medium=aggregator&utm_campaign=symbol; MF: Analog Devices; MP: ADP323ACPZ-R7; PACKAGE: LFCSP-16 Analog Devices
U7 = library:TLV70215DBVR
U8 = library:NCP361SNT1G
U9 = library:TLV70225